# Altium schematic sheet halfbridge.SchDoc
size B
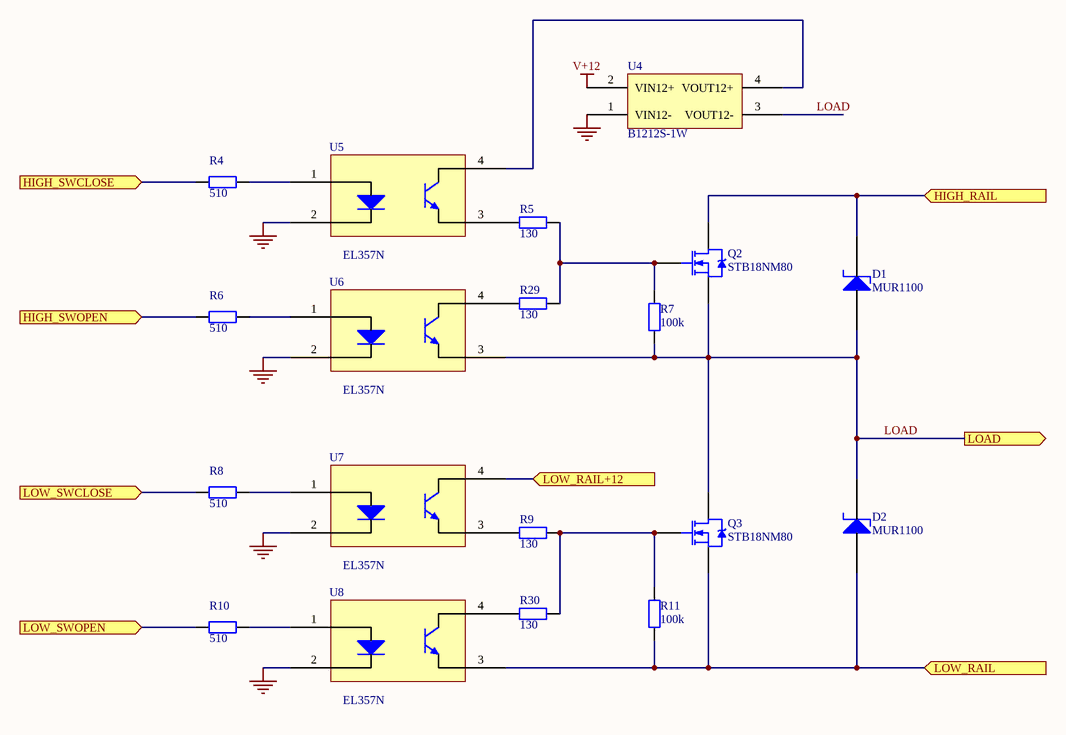
[diagram p0: halfbridge.SchDoc]

## Parts
D1  MUR1100  [DIODE-0.4]
D2  MUR1100  [DIODE-0.4]
Q2  STB18NM80  [STB18NM80]
Q3  STB18NM80  [STB18NM80]
R4  510  [RESC1608L]
R5  130  [RESC1608L]
R6  510  [RESC1608L]
R7  100k  [RESC1608L]
R8  510  [RESC1608L]
R9  130  [RESC1608L]
R10  510  [RESC1608L]
R11  100k  [RESC1608L]
R29  130  [RESC1608L]
R30  130  [RESC1608L]
U4  B1212S-1W  [B1212S-1W]
U5  EL357N  [EL357N]
U6  EL357N  [EL357N]
U7  EL357N  [EL357N]
U8  EL357N  [EL357N]

## Ports
HIGH_RAIL (in), HIGH_SWCLOSE (in), HIGH_SWOPEN (in), LOAD (out), LOW_RAIL (in), LOW_RAIL+12 (in), LOW_SWCLOSE (in), LOW_SWOPEN (in)

## Nets
GND: U4.1(VIN12-) U5.2(Cathode) U6.2(Cathode) U7.2(Cathode) U8.2(Cathode)
V+12: U4.2(VIN12+)
HIGH_RAIL: D1.2 Q2.2(D) ; port HIGH_RAIL
HIGH_SWCLOSE: R4.1 ; port HIGH_SWCLOSE
HIGH_SWOPEN: R6.1 ; port HIGH_SWOPEN
LOAD: D1.1 D2.2 Q2.3(S) Q3.2(D) R7.1 U4.3(VOUT12-) U6.3(Emitter) ; port LOAD
LOW_RAIL: D2.1 Q3.3(S) R11.1 U8.3(Emitter) ; port LOW_RAIL
LOW_RAIL+12: U7.4(Collector) ; port LOW_RAIL+12
LOW_SWCLOSE: R8.1 ; port LOW_SWCLOSE
LOW_SWOPEN: R10.1 ; port LOW_SWOPEN
NetQ2_1: Q2.1(G) R5.2 R7.2 R29.2
NetQ3_1: Q3.1(G) R9.2 R11.2 R30.2
NetR4_2: R4.2 U5.1(Anode)
NetR5_1: R5.1 U5.3(Emitter)
NetR6_2: R6.2 U6.1(Anode)
NetR8_2: R8.2 U7.1(Anode)
NetR9_1: R9.1 U7.3(Emitter)
NetR10_2: R10.2 U8.1(Anode)
NetR29_1: R29.1 U6.4(Collector)
NetR30_1: R30.1 U8.4(Collector)
NetU4_4: U4.4(VOUT12+) U5.4(Collector)

## Library data of the parts
R4-R11 R29 R30 = Res2: Resistor; Published: 8-Jun-2000; LatestRevisionDate: 17-Jul-2002; LatestRevisionNote: Re-released for DXP Platform.; PackageReference: AXIAL-0.4; Publisher: Altium Limited
  R4 R6 R8 R10: Value: 510
  R5 R9 R29 R30: Value: 130
  R7 R11: Value: 100k
U5-U8 = EL367N